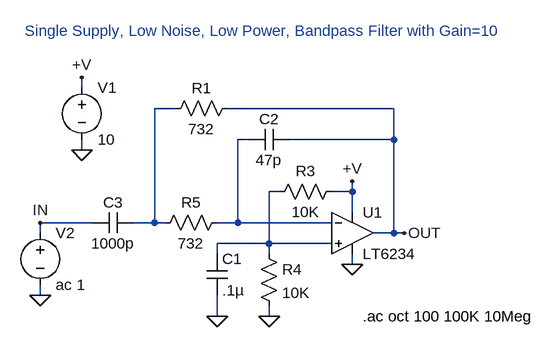
[diagram p0: schematic 6234.asc]
6234.asc, the LTspice schematic file:
Version 4
SHEET 1 896 680
WIRE -336 -32 -336 -48
WIRE -192 0 -224 0
WIRE 144 0 -112 0
WIRE -80 48 -96 48
WIRE 144 48 144 0
WIRE 144 48 -16 48
WIRE -336 64 -336 48
WIRE -32 128 -48 128
WIRE 80 128 80 112
WIRE 80 128 48 128
WIRE 80 160 80 128
WIRE -320 176 -400 176
WIRE -224 176 -224 0
WIRE -224 176 -256 176
WIRE -208 176 -224 176
WIRE -96 176 -96 48
WIRE -96 176 -128 176
WIRE 48 176 -96 176
WIRE -400 192 -400 176
WIRE 144 192 144 48
WIRE 144 192 112 192
WIRE 160 192 144 192
WIRE -48 208 -48 128
WIRE -48 208 -128 208
WIRE 48 208 -48 208
WIRE -128 224 -128 208
WIRE -48 224 -48 208
WIRE 80 240 80 224
WIRE -400 288 -400 272
WIRE -128 320 -128 288
WIRE -48 320 -48 304
FLAG -336 64 0
FLAG 80 112 +V
FLAG -336 -48 +V
FLAG -48 320 0
FLAG -128 320 0
FLAG -400 288 0
FLAG 160 192 OUT
FLAG -400 176 IN
FLAG 80 240 0
SYMBOL voltage -336 -48 R0
SYMATTR InstName V1
SYMATTR Value 10
SYMBOL res -96 -16 R90
WINDOW 0 0 56 VBottom 0
WINDOW 3 32 56 VTop 0
SYMATTR InstName R1
SYMATTR Value 732
SYMBOL res 64 112 R90
WINDOW 0 0 56 VBottom 0
WINDOW 3 32 56 VTop 0
SYMATTR InstName R3
SYMATTR Value 10K
SYMBOL res -64 208 R0
SYMATTR InstName R4
SYMATTR Value 10K
SYMBOL cap -144 224 R0
SYMATTR InstName C1
SYMATTR Value .1µ
SYMBOL cap -16 32 R90
WINDOW 0 0 32 VBottom 0
WINDOW 3 32 32 VTop 0
SYMATTR InstName C2
SYMATTR Value 47p
SYMBOL res -112 160 R90
WINDOW 0 0 56 VBottom 0
WINDOW 3 32 56 VTop 0
SYMATTR InstName R5
SYMATTR Value 732
SYMBOL cap -256 160 R90
WINDOW 0 0 32 VBottom 0
WINDOW 3 32 32 VTop 0
SYMATTR InstName C3
SYMATTR Value 1000p
SYMBOL voltage -400 176 R0
SYMATTR InstName V2
SYMATTR Value ac 1
SYMBOL opamps\\LT6234 80 192 R0
SYMATTR InstName U1
TEXT 96 320 Left 0 !.ac oct 100 100K 10Meg
TEXT -56 -104 Bottom 0 ;Single Supply, Low Noise, Low Power, Bandpass Filter with Gain=10

The netlist it stands for:
* 6234.asc
V1 +V 0 10
R1 OUT N001 732
R3 +V N003 10K
R4 N003 0 10K
C1 N003 0 .1µ
C2 OUT N002 47p
R5 N002 N001 732
C3 N001 IN 1000p
V2 IN 0 ac 1
* U1: LT6234 (symbol opamps\LT6234 not available, pins judged from their places): In+=N003 In-=N002 V+=+V V-=0 OUT=OUT
.ac oct 100 100K 10Meg
* Single Supply, Low Noise, Low Power, Bandpass Filter with Gain=10
.backanno
.end